# Altium project SkyDriver飞行控制器-IMU板V2.PrjPCB
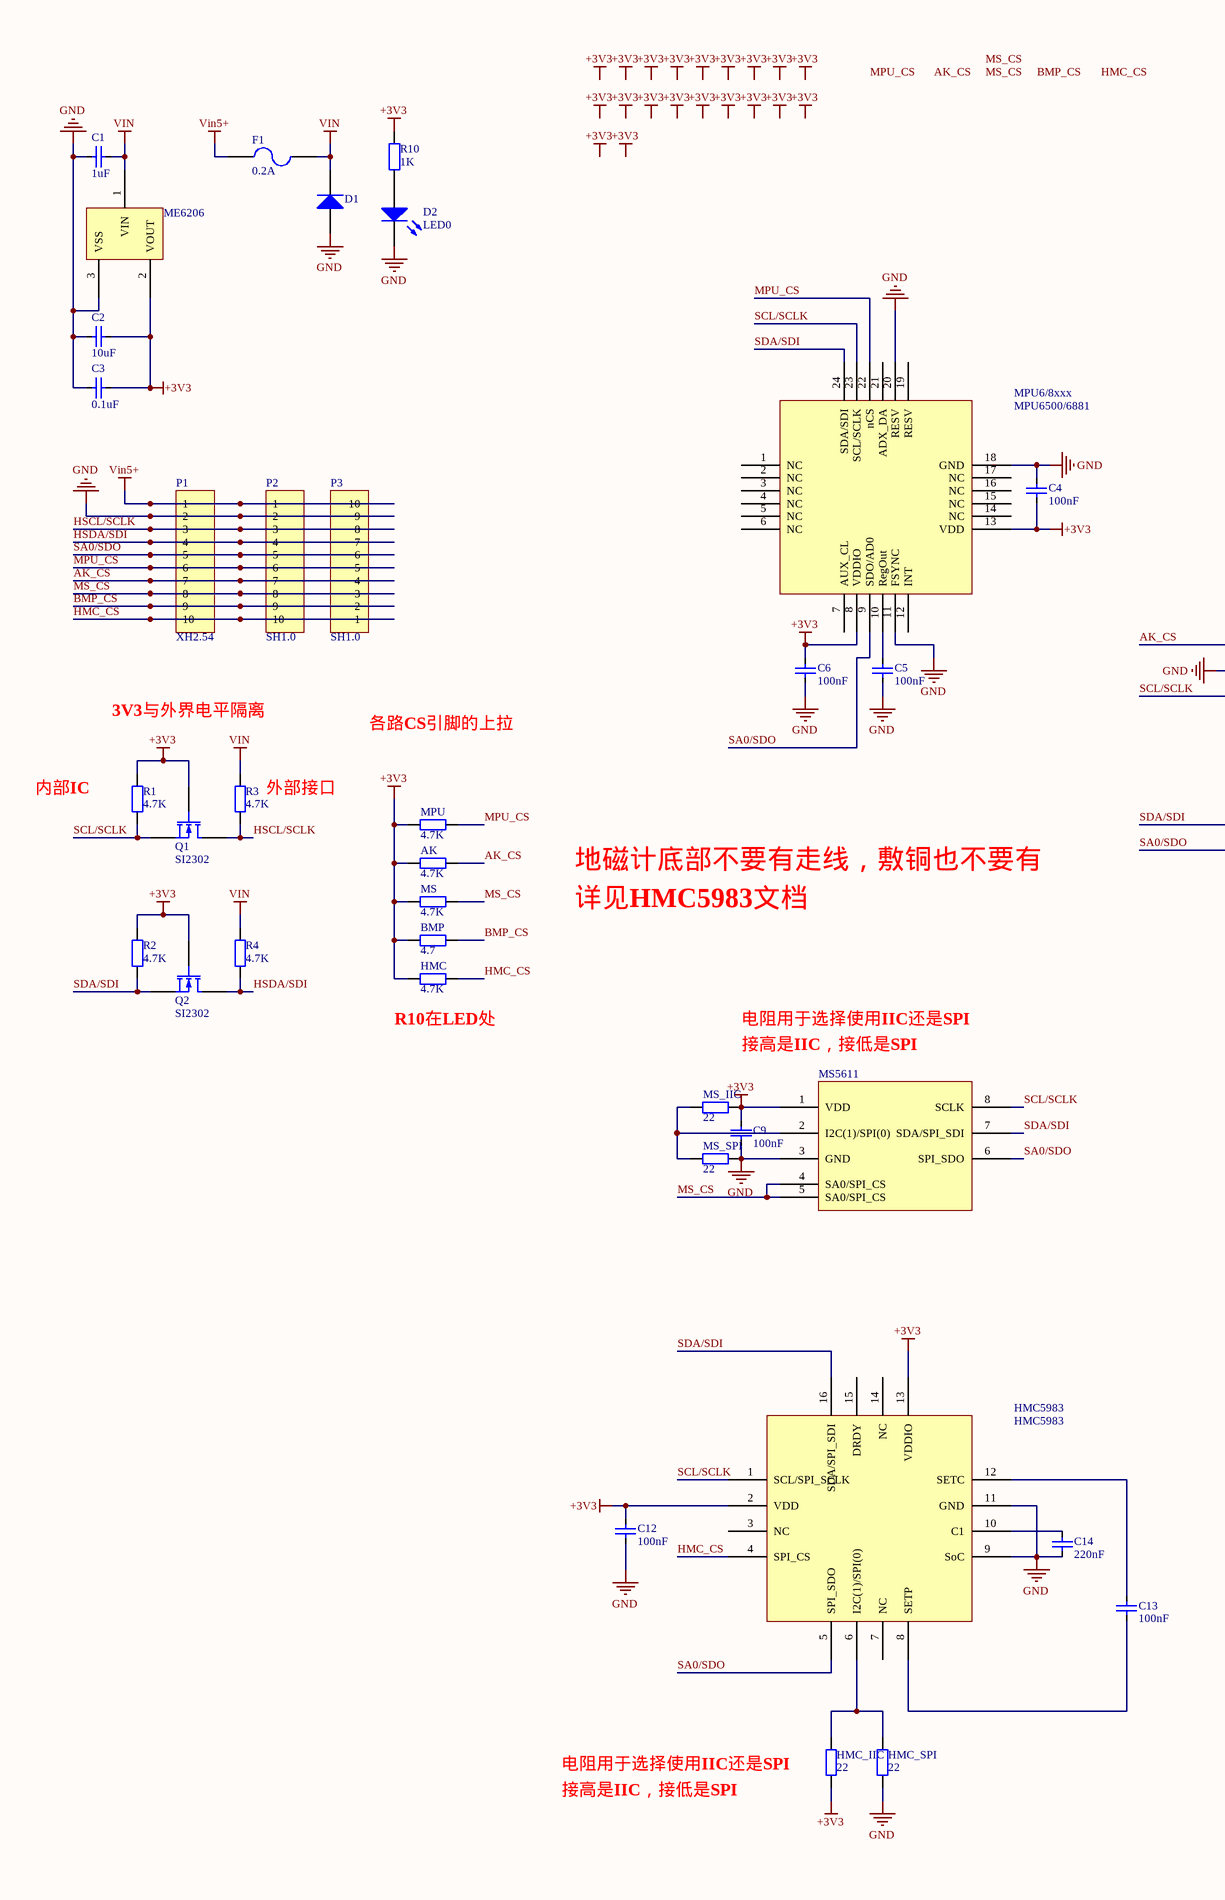
[diagram p0: SkyDriver飞行控制器-IMU板V2.SchDoc, left]
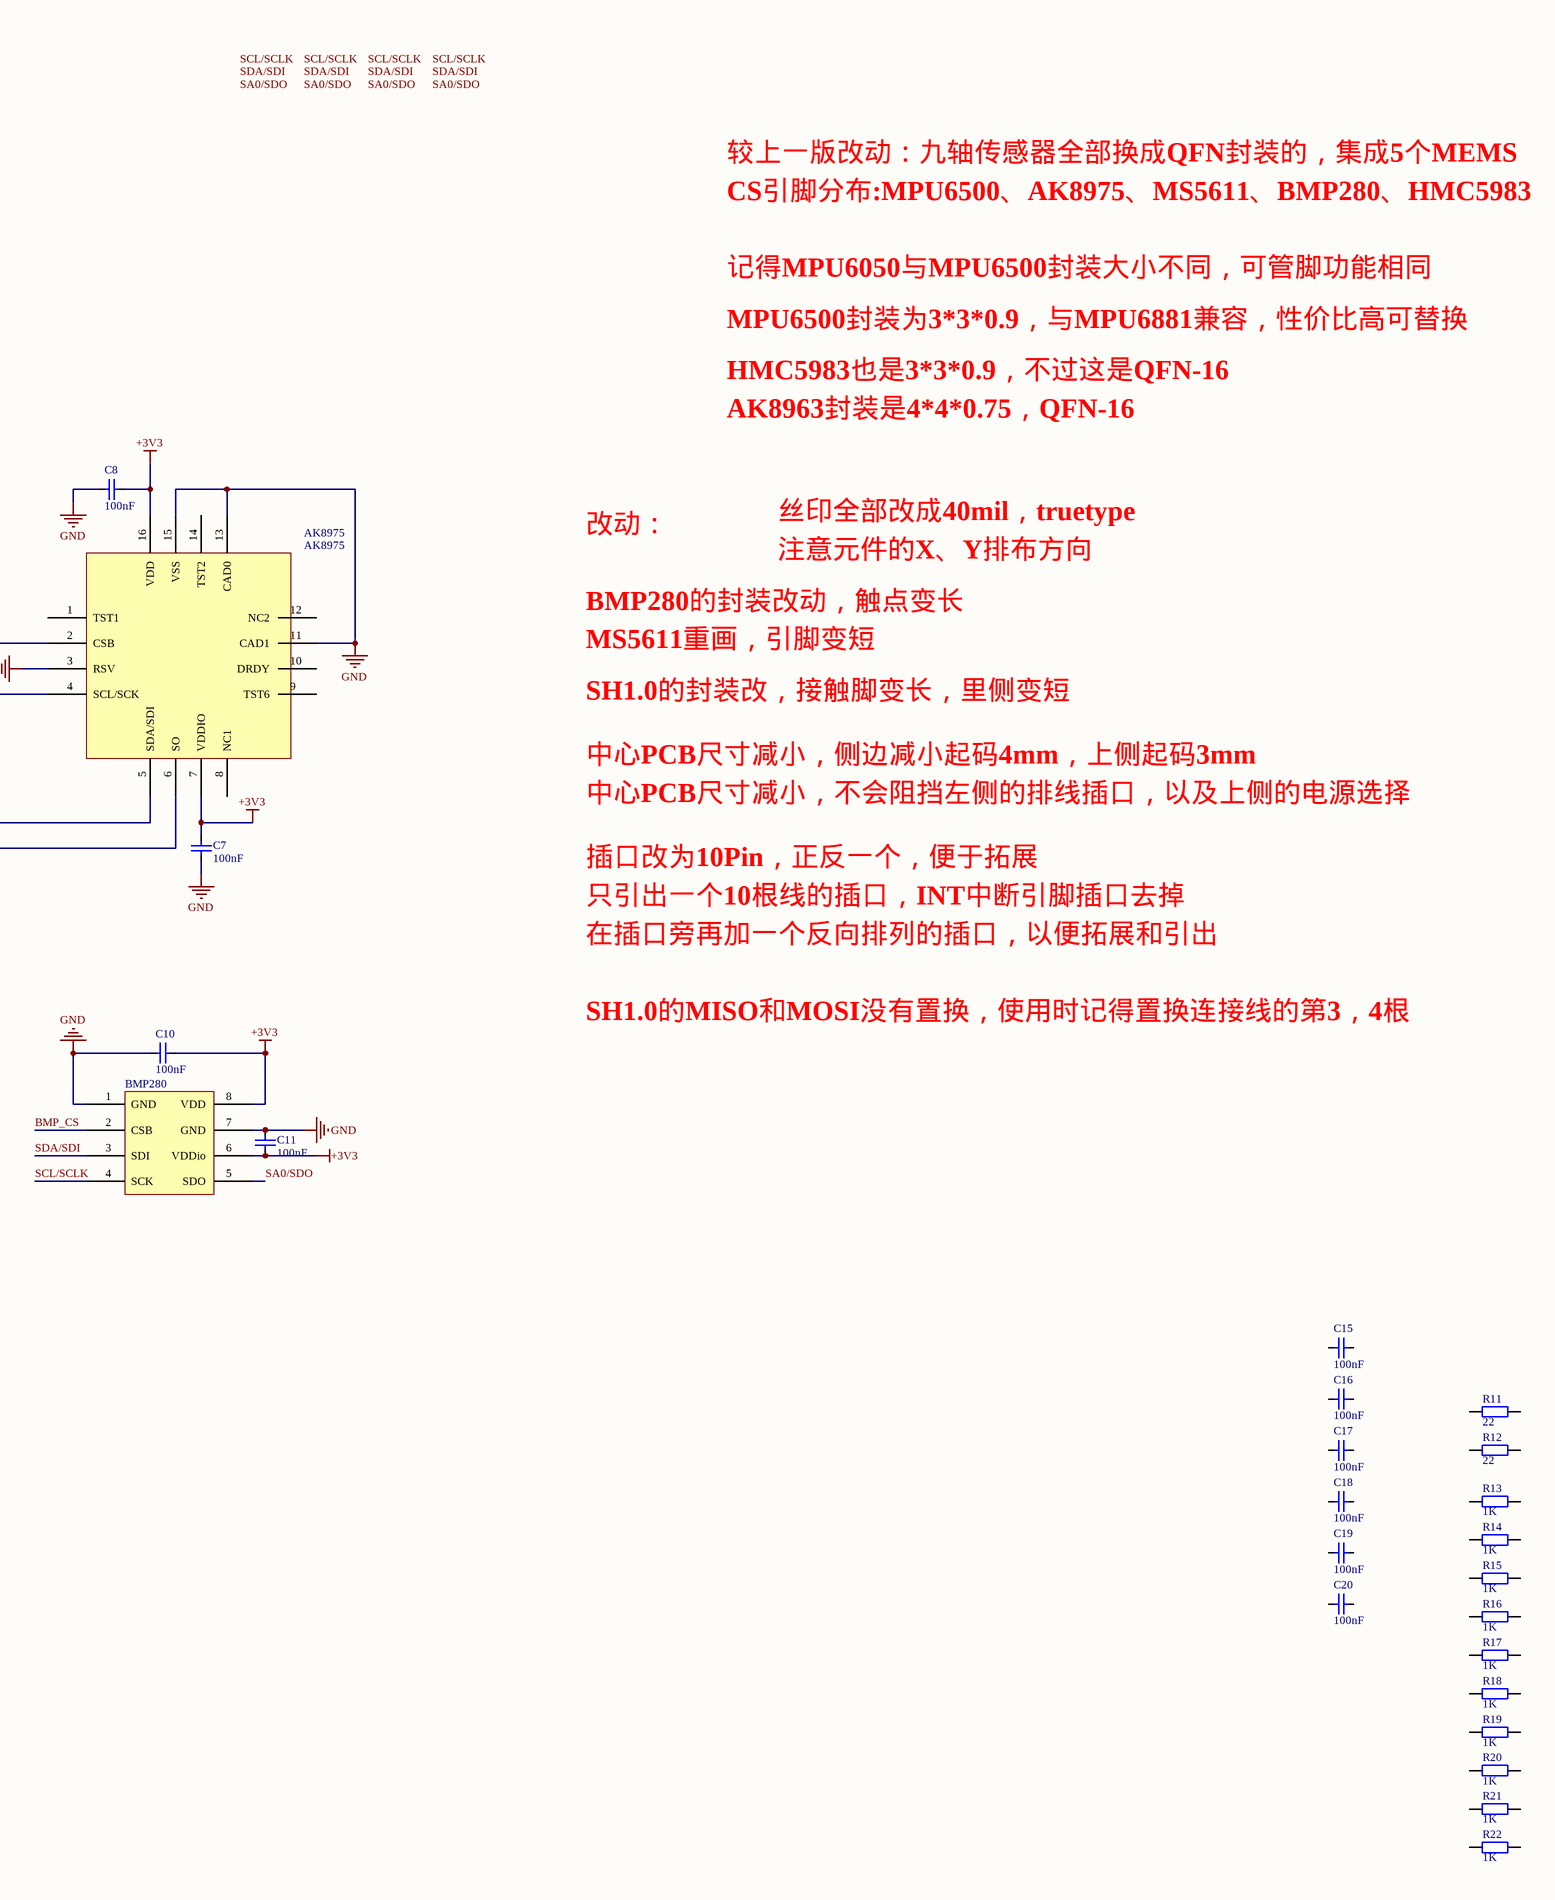
[diagram p1: SkyDriver飞行控制器-IMU板V2.SchDoc, right]
1 sheet, 60 parts. Net scope: global (net labels, ports and power ports of the same name join across sheets).
Board file: SkyDriver飞行控制器-IMU板V2.PcbDoc

## Sheet SkyDriver飞行控制器-IMU板V2.SchDoc
size A2

### Parts
AK  value 4.7K  [RES_0603]  (hidden comment: Res_0603)
AK8975  AK8975  [QFN16M - 4*4]
BMP  value 4.7  [RES_0603]  (hidden comment: Res_0603)
BMP280  BMP280  [LGA8 - BMP280]  (value not drawn)
C1  value 1uF  [CAP_0603]  (hidden comment: Cap_0603)
C2  value 10uF  [CAP_0603]  (hidden comment: Cap_0603)
C3  value 0.1uF  [CAP_0603]  (hidden comment: Cap_0603)
C4  value 100nF  [CAP_0603]  (hidden comment: Cap_0603)
C5  value 100nF  [CAP_0603]  (hidden comment: Cap_0603)
C6  value 100nF  [CAP_0603]  (hidden comment: Cap_0603)
C7  value 100nF  [CAP_0603]  (hidden comment: Cap_0603)
C8  value 100nF  [CAP_0603]  (hidden comment: Cap_0603)
C9  value 100nF  [CAP_0603]  (hidden comment: Cap_0603)
C10  value 100nF  [CAP_0603]  (hidden comment: Cap_0603)
C11  value 100nF  [CAP_0603]  (hidden comment: Cap_0603)
C12  value 100nF  [CAP_0603]  (hidden comment: Cap_0603)
C13  value 100nF  [CAP_0603]  (hidden comment: Cap_0603)
C14  value 220nF  [CAP_0603]  (hidden comment: Cap_0603)
C15  value 100nF  [CAP_0603]  (hidden comment: Cap_0603)
C16  value 100nF  [CAP_0603]  (hidden comment: Cap_0603)
C17  value 100nF  [CAP_0603]  (hidden comment: Cap_0603)
C18  value 100nF  [CAP_0603]  (hidden comment: Cap_0603)
C19  value 100nF  [CAP_0603]  (hidden comment: Cap_0603)
C20  value 100nF  [CAP_0603]  (hidden comment: Cap_0603)
D1  SS14  [SOD323]  (value not drawn)
D2  LED0  [LED_0805]
F1  value 0.2A  [0805s]  (hidden comment: Fuse)
HMC  value 4.7K  [RES_0603]  (hidden comment: Res_0603)
HMC5983  HMC5983  [QFN16M - 3*3]
HMC_IIC  value 22  [RES_0603]  (hidden comment: Res_0603)
HMC_SPI  value 22  [RES_0603]  (hidden comment: Res_0603)
ME6206  ME6206  [sot23_M]  (value not drawn)
MPU  value 4.7K  [RES_0603]  (hidden comment: Res_0603)
MPU6/8xxx  MPU6500/6881  [QFN24M - 3*3]
MS  value 4.7K  [RES_0603]  (hidden comment: Res_0603)
MS5611  MS5611  [QFN8 - MS5611]  (value not drawn)
MS_IIC  value 22  [RES_0603]  (hidden comment: Res_0603)
MS_SPI  value 22  [RES_0603]  (hidden comment: Res_0603)
P1  XH2.54  [HDR1X10]
P2  SH1.0  [SH1.0_Header10]
P3  SH1.0  [SH1.0_Header10]
Q1  SI2302  [SOT-23]
Q2  SI2302  [SOT-23]
R1  value 4.7K  [RES_0603]  (hidden comment: Res_0603)
R2  value 4.7K  [RES_0603]  (hidden comment: Res_0603)
R3  value 4.7K  [RES_0603]  (hidden comment: Res_0603)
R4  value 4.7K  [RES_0603]  (hidden comment: Res_0603)
R10  value 1K  [RES_0603]  (hidden comment: Res_0603)
R11  value 22  [RES_0603]  (hidden comment: Res_0603)
R12  value 22  [RES_0603]  (hidden comment: Res_0603)
R13  value 1K  [RES_0603]  (hidden comment: Res_0603)
R14  value 1K  [RES_0603]  (hidden comment: Res_0603)
R15  value 1K  [RES_0603]  (hidden comment: Res_0603)
R16  value 1K  [RES_0603]  (hidden comment: Res_0603)
R17  value 1K  [RES_0603]  (hidden comment: Res_0603)
R18  value 1K  [RES_0603]  (hidden comment: Res_0603)
R19  value 1K  [RES_0603]  (hidden comment: Res_0603)
R20  value 1K  [RES_0603]  (hidden comment: Res_0603)
R21  value 1K  [RES_0603]  (hidden comment: Res_0603)
R22  value 1K  [RES_0603]  (hidden comment: Res_0603)

### Nets
+3V3: AK.1 AK8975.7(VDDIO) AK8975.16(VDD) BMP.2 BMP280.6(VDDio) BMP280.8(VDD) C2.1 C3.1 C4.1 C6.2 C7.2 C8.1 C9.2 C10.1 C11.1 C12.2 HMC.1 HMC5983.2(VDD) HMC5983.13(VDDIO) HMC_IIC.1 ME6206.2(VOUT) MPU.1 MPU6/8xxx.8(VDDIO) MPU6/8xxx.13(VDD) MS.1 MS5611.1(VDD) MS_IIC.1 Q1.2(G) Q2.2(G) R1.1 R2.2 R10.2
GND: AK8975.3(RSV) AK8975.11(CAD1) AK8975.13(CAD0) AK8975.15(VSS) BMP280.1(GND) BMP280.7(GND) C1.2 C2.2 C3.2 C4.2 C5.1 C6.1 C7.1 C8.2 C9.1 C10.2 C11.2 C12.1 C14.1 D1.1(A) D2.2(K) HMC5983.9(SoC) HMC5983.11(GND) HMC_SPI.1 ME6206.3(VSS) MPU6/8xxx.11(FSYNC) MPU6/8xxx.18(GND) MPU6/8xxx.20(RESV) MS5611.3(GND) MS_SPI.1 P1.2 P2.2 P3.9
VIN: C1.1 D1.2(K) F1.2 ME6206.1(VIN) R3.2 R4.2
Vin5+: F1.1 P1.1 P2.1 P3.10
AK_CS: AK.2 AK8975.2(CSB) P1.7 P2.7 P3.4
BMP_CS: BMP.1 BMP280.2(CSB) P1.9 P2.9 P3.2
HMC_CS: HMC.2 HMC5983.4(SPI_CS) P1.10 P2.10 P3.1
HSCL/SCLK: P1.3 P2.3 P3.8 Q1.1(D) R3.1
HSDA/SDI: P1.4 P2.4 P3.7 Q2.1(D) R4.1
MPU_CS: MPU.2 MPU6/8xxx.22(nCS) P1.6 P2.6 P3.5
MS_CS: MS.2 MS5611.4(SA0/SPI_CS) MS5611.5(SA0/SPI_CS) P1.8 P2.8 P3.3
SA0/SDO: AK8975.6(SO) BMP280.5(SDO) HMC5983.5(SPI_SDO) MPU6/8xxx.9(SDO/AD0) MS5611.6(SPI_SDO) P1.5 P2.5 P3.6
SCL/SCLK: AK8975.4(SCL/SCK) BMP280.4(SCK) HMC5983.1(SCL/SPI_SCLK) MPU6/8xxx.23(SCL/SCLK) MS5611.8(SCLK) Q1.3(S) R1.2
SDA/SDI: AK8975.5(SDA/SDI) BMP280.3(SDI) HMC5983.16(SDA/SPI_SDI) MPU6/8xxx.24(SDA/SDI) MS5611.7(SDA/SPI_SDI) Q2.3(S) R2.1
NetC5_2: C5.2 MPU6/8xxx.10(RegOut)
NetC13_1: C13.1 HMC5983.8(SETP)
NetC13_2: C13.2 HMC5983.12(SETC)
NetC14_2: C14.2 HMC5983.10(C1)
NetD2_1: D2.1(A) R10.1
NetHMC5983_6: HMC5983.6(I2C(1)/SPI(0)) HMC_IIC.2 HMC_SPI.2
NetMS5611_2: MS5611.2(I2C(1)/SPI(0)) MS_IIC.2 MS_SPI.2

Not connected (* = marked no-connect by the designer): AK8975 1(TST1) 8(NC1) 9(TST6) 10(DRDY) 12(NC2) 14(TST2); C15 1 2; C16 1 2; C17 1 2; C18 1 2; C19 1 2; C20 1 2; HMC5983 3(NC) 7(NC) 14(NC) 15(DRDY); MPU6/8xxx 1(NC) 2(NC) 3(NC) 4(NC) 5(NC) 6(NC) 7(AUX_CL) 12(INT) 14(NC) 15(NC) 16(NC) 17(NC) 19(RESV) 21(ADX_DA); R11 1 2; R12 1 2; R13 1 2; R14 1 2; R15 1 2; R16 1 2; R17 1 2; R18 1 2; R19 1 2; R20 1 2; R21 1 2; R22 1 2

### Notes on the sheet
- 较上一版改动：九轴传感器全部换成QFN封装的，集成5个MEMS
- CS引脚分布:MPU6500、AK8975、MS5611、BMP280、HMC5983
- 记得MPU6050与MPU6500封装大小不同，可管脚功能相同
- MPU6500封装为3*3*0.9，与MPU6881兼容，性价比高可替换
- HMC5983也是3*3*0.9，不过这是QFN-16
- AK8963封装是4*4*0.75，QFN-16
- 改动：
- 丝印全部改成40mil，truetype
- 注意元件的X、Y排布方向
- BMP280的封装改动，触点变长
- MS5611重画，引脚变短
- 3V3与外界电平隔离
- 各路CS引脚的上拉
- SH1.0的封装改，接触脚变长，里侧变短
- 内部IC
- (near R3) 外部接口
- 中心PCB尺寸减小，不会阻挡左侧的排线插口，以及上侧的电源选择
- 中心PCB尺寸减小，侧边减小起码4mm，上侧起码3mm
- 地磁计底部不要有走线，敷铜也不要有
- 插口改为10Pin，正反一个，便于拓展
- 详见HMC5983文档
- 只引出一个10根线的插口，INT中断引脚插口去掉
- 在插口旁再加一个反向排列的插口，以便拓展和引出
- (near HMC) R10在LED处
- 电阻用于选择使用IIC还是SPI
- 接高是IIC，接低是SPI
- SH1.0的MISO和MOSI没有置换，使用时记得置换连接线的第3，4根
- Labels drawn without touching a wire or pin: +3V3, AK_CS, BMP_CS, HMC_CS, MPU_CS, MS_CS, SA0/SDO, SCL/SCLK, SDA/SDI

### Library data of the parts
AK BMP HMC HMC_IIC HMC_SPI MPU MS MS_IIC MS_SPI R1-R4 R10-R22 = Res_0603: Resistor
C1-C20 = Cap_0603: Capacitor
D1 = Diode 1N4007: 1 Amp General Purpose Rectifier; Published: 8-Jun-2000; LatestRevisionDate: 17-Jul-2002; LatestRevisionNote: Re-released for DXP Platform.; DatasheetVersion: 1998; PackageVersion: Aug-1999; PackageReference: DO-41; Publisher: Altium Limited; PackageDescription: Diode, Axial; Body 5.2 x 2.7 mm (LxDia. max), Lead Dia. 0.86 mm (max); Code_JEDEC: DO-204-AL; ComponentLink1Description: Manufacturer Link; ComponentLink1URL: http://www.fairchildsemi.com/; ComponentLink2Description: Datasheet; ComponentLink2URL: http://www.fairchildsemi.com/ds/1N%2F1N4001.pdf
D2 = LED0: Typical INFRARED GaAs LED; Published: 8-Jun-2000; LatestRevisionDate: 08-Jul-2005; LatestRevisionNote: Mech Layer 1 removed.; PackageReference: LED-0; Publisher: Altium Limited
F1 = Fuse 2: 保险丝; Published: 8-Jun-2000; LatestRevisionDate: 17-Jul-2002; LatestRevisionNote: Re-released for DXP Platform.; PackageReference: PIN-W2/E2.8; Publisher: Altium Limited
P1-P3 = Header 10: Header, 10-Pin; LatestRevisionDate: 17-Jul-2002; LatestRevisionNote: Re-released for DXP Platform.; Publisher: Altium Limited
Q1 Q2 = MOSFET-N: N-Channel MOSFET; pin to pad: 1>3 2>1 3>2; Published: 8-Jun-2000; LatestRevisionDate: 17-Jul-2002; LatestRevisionNote: Re-released for DXP Platform.; PackageVersion: 1995/1996; PackageReference: E3; Publisher: Altium Limited